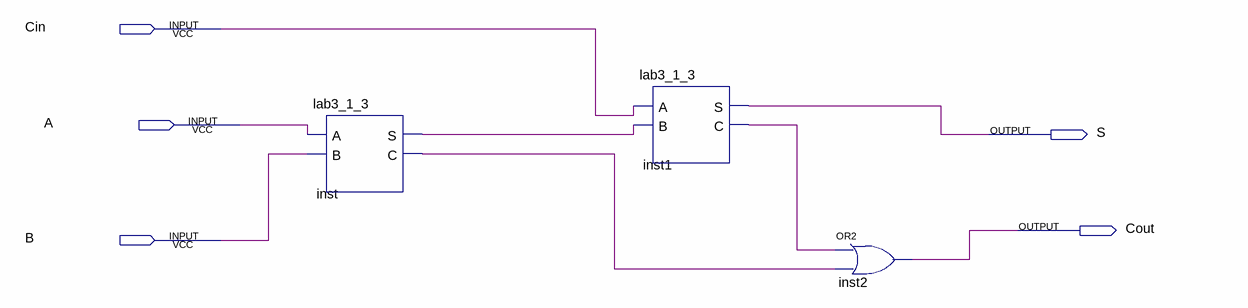
[diagram p0: schematic sheet]
// Quartus schematic lab3_1_4.bdf as structural Verilog: 3 symbols, 5 pins
module lab3_1_4 (
  input  Cin,
  input  A,
  input  B,
  output S,
  output Cout
);

  wire inst1_c, inst_c, inst_s;

  lab3_1_3 inst (.A(A), .B(B), .S(inst_s), .C(inst_c));
  lab3_1_3 inst1 (.A(Cin), .B(inst_s), .S(S), .C(inst1_c));
  or inst2 (Cout, inst1_c, inst_c);
endmodule
